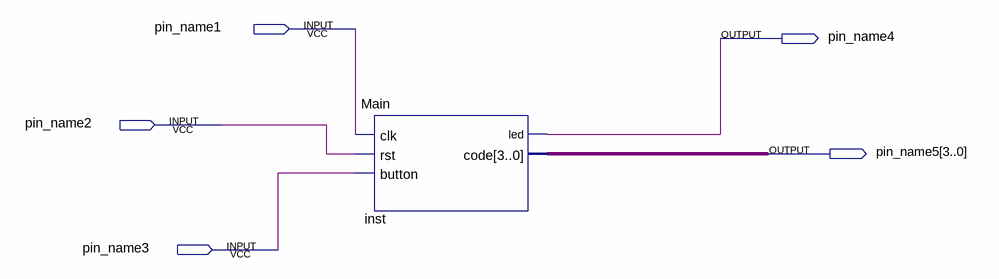
[diagram p0: schematic sheet]
// Quartus schematic Block1.bdf as structural Verilog: 1 symbols, 5 pins
module Block1 (
  input  pin_name1,
  input  pin_name2,
  input  pin_name3,
  output pin_name4,
  output [3:0] pin_name5
);

  Main inst (.clk(pin_name1), .rst(pin_name2), .button(pin_name3), .led(pin_name4), .code(pin_name5));
endmodule
